# EAGLE schematic HshMain_v1.0 (EAGLE 7.4.0)
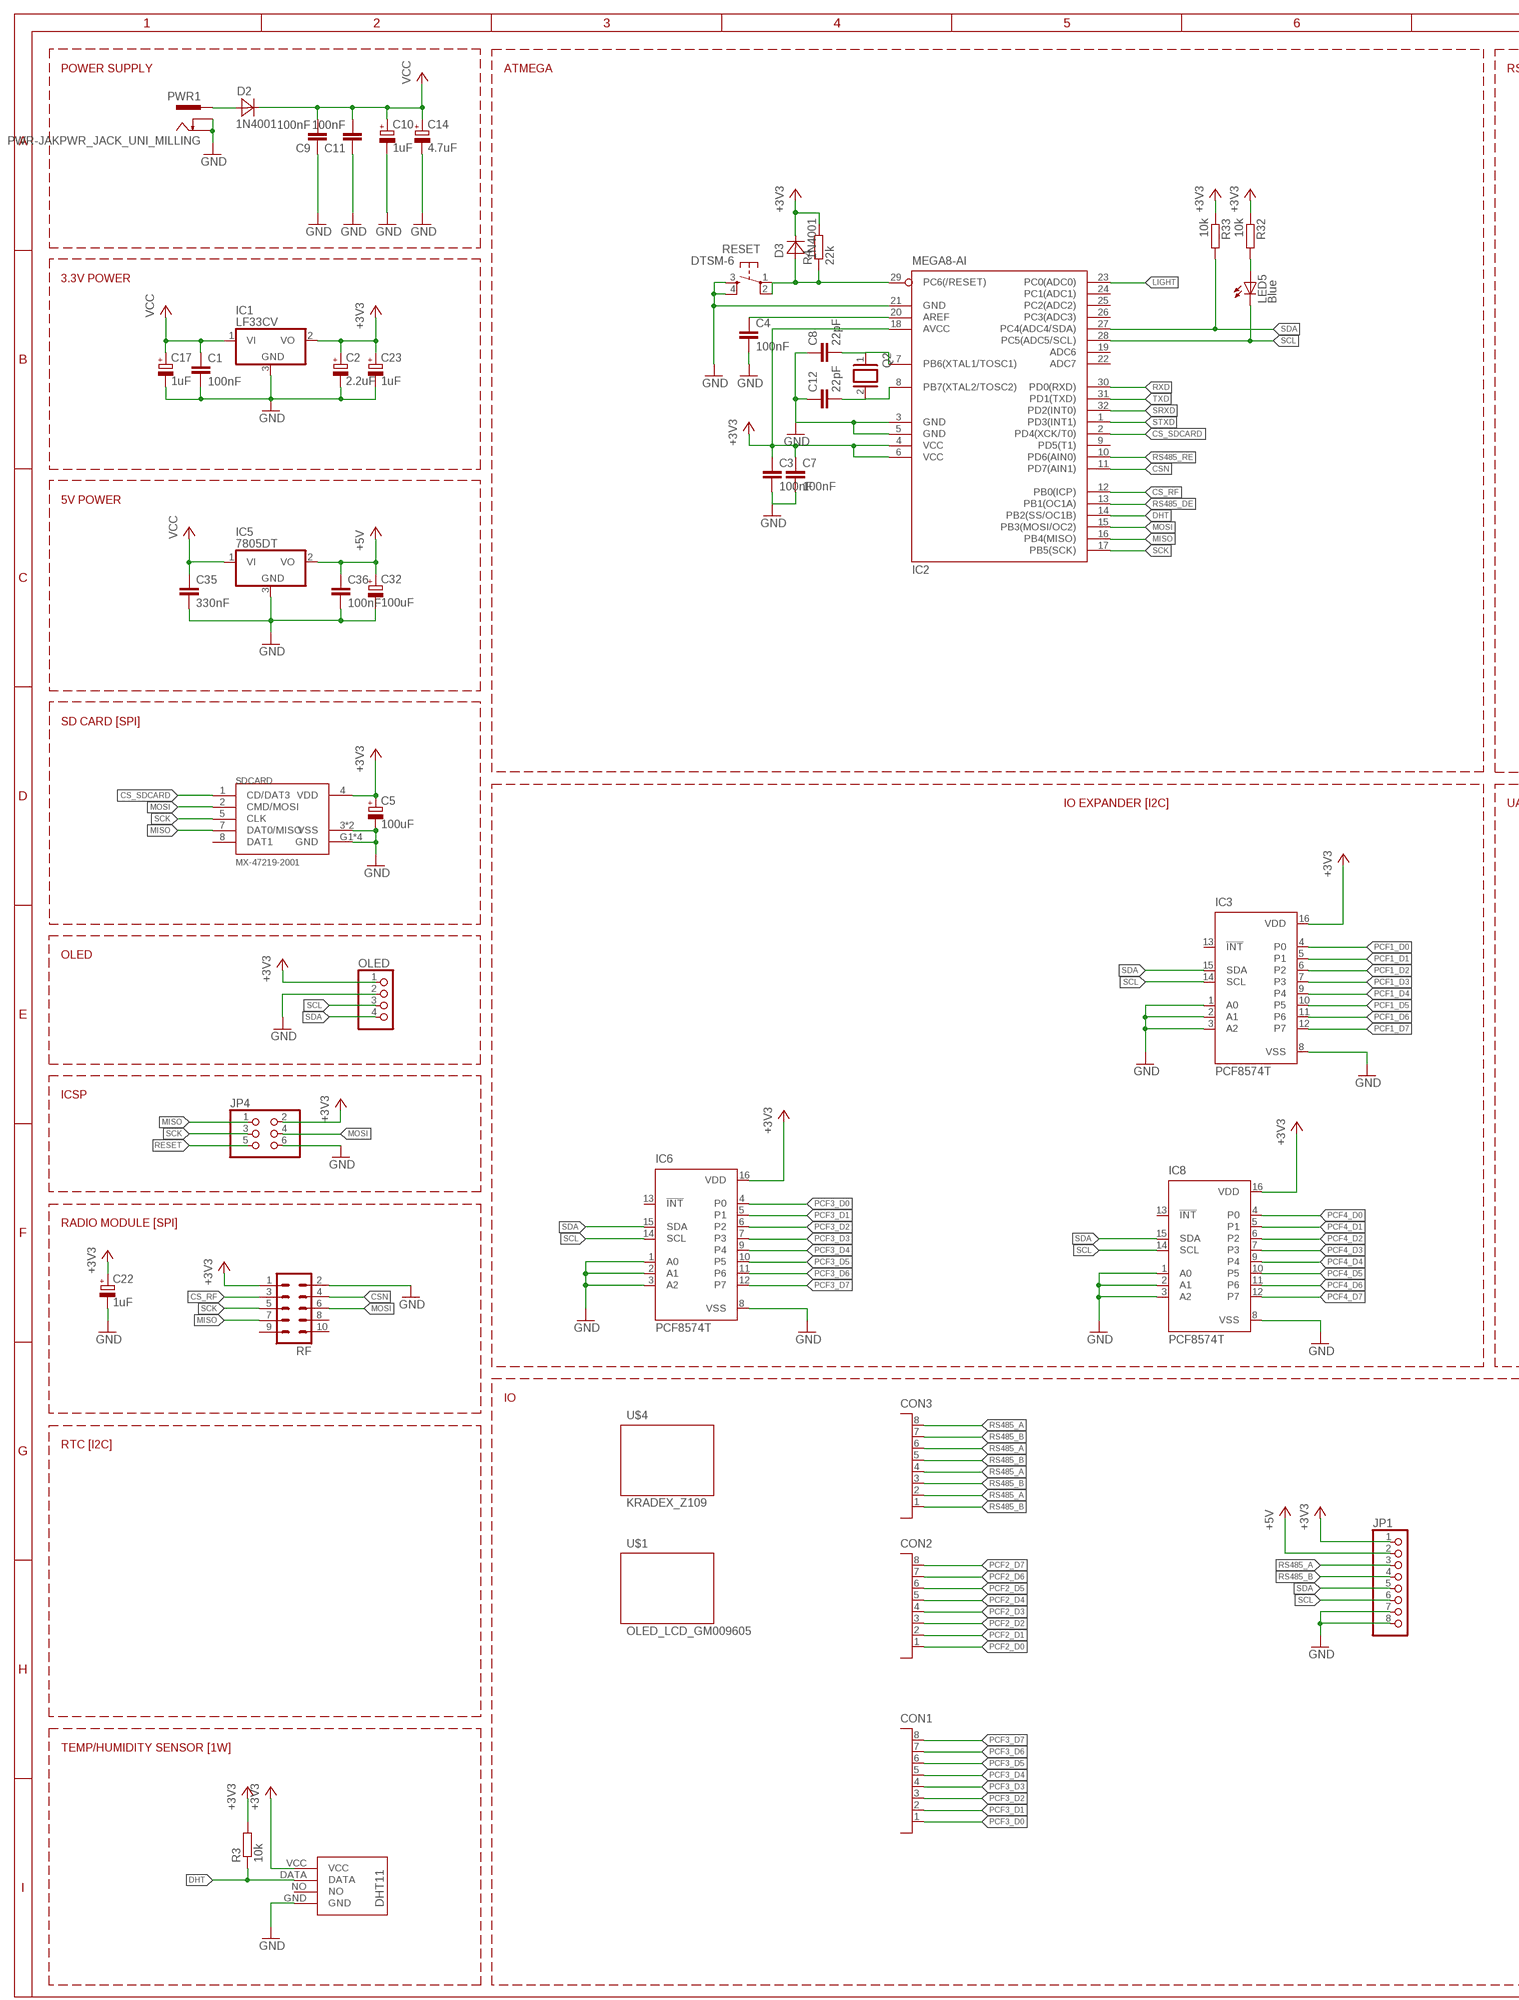
[diagram p0: schematic, sheet 1, part 1 of 2]
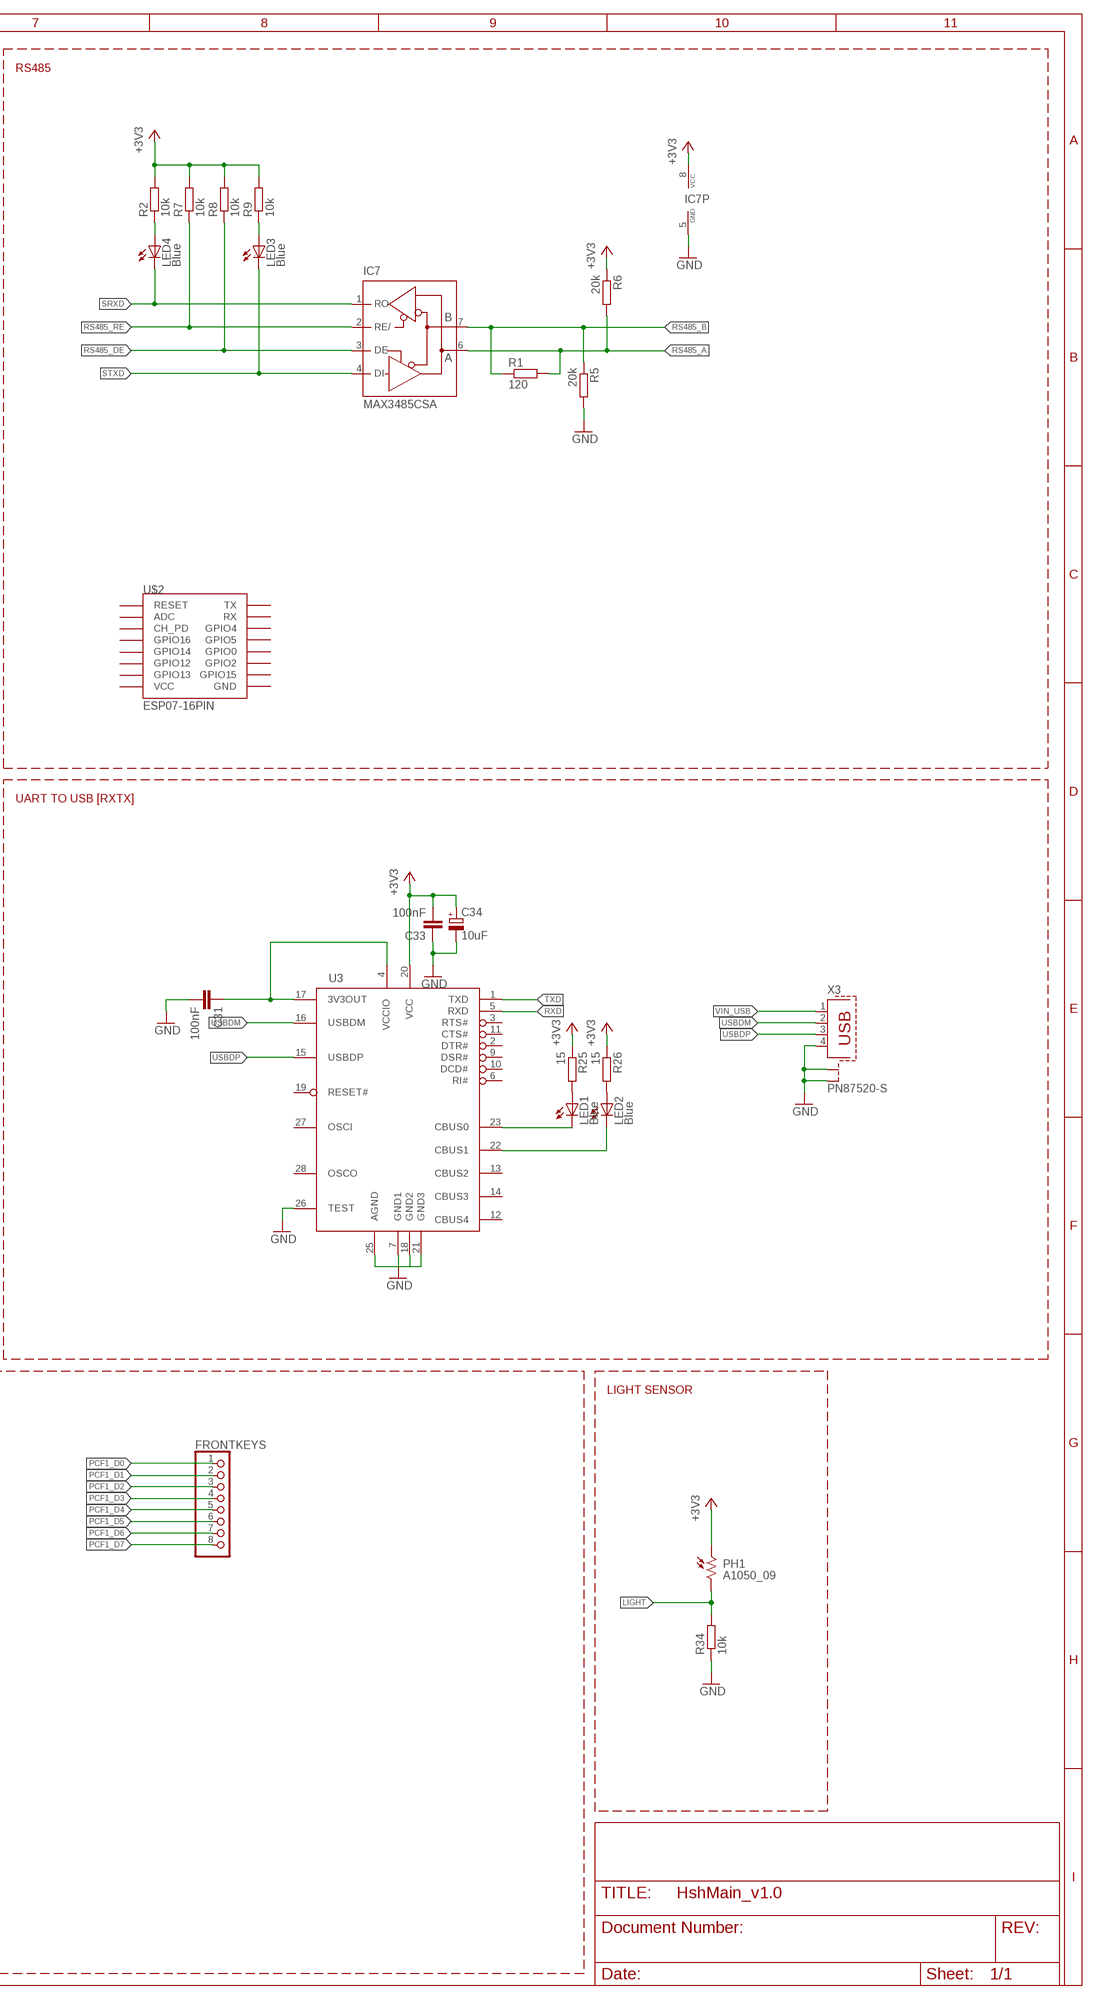
[diagram p1: schematic, sheet 1, part 2 of 2]

## Parts
C1  100nF  C-EUC0805  [C0805]
C2  2.2uF  CPOL-EUB  [PANASONIC_B]
C3  100nF  C-EUC0805  [C0805]
C4  100nF  C-EUC0805  [C0805]
C5  100uF  CPOL-EUD  [PANASONIC_D]
C7  100nF  C-EUC0805  [C0805]
C8  22pF  C-EUC0805  [C0805]
C9  100nF  C-EUC0805  [C0805]
C10  1uF  CPOL-EUB  [PANASONIC_B]
C11  100nF  C-EUC0805  [C0805]
C12  22pF  C-EUC0805  [C0805]
C14  4.7uF  CPOL-EUB  [PANASONIC_B]
C17  1uF  CPOL-EUB  [PANASONIC_B]
C22  1uF  CPOL-EUB  [PANASONIC_B]
C23  1uF  CPOL-EUB  [PANASONIC_B]
C31  100nF  C-EUC0805  [C0805]
C32  100uF  CPOL-EUD  [PANASONIC_D]
C33  100nF  C-EUC0805  [C0805]
C34  10uF  CPOL-EUB  [PANASONIC_B]
C35  330nF  C-EUC0805  [C0805]
C36  100nF  C-EUC0805  [C0805]
CON1  15EDGRC-3.81-8P  [15EDGRC-3.81-8P]
CON2  15EDGRC-3.81-8P  [15EDGRC-3.81-8P]
CON3  15EDGRC-3.81-8P  [15EDGRC-3.81-8P]
D2  1N4001  MBRA340T3  [SMA]
D3  1N4001  MBRA340T3  [SMA]
FRONTKEYS  PINHD-1X8/90  [1X08/90]
IC1  LF33CV  78DT  [TO252]
IC2  MEGA8-AI  [TQFP32-08]
IC3  PCF8574T  [SO16W]
IC5  7805DT  [TO252]
IC6  PCF8574T  [SO16W]
IC7  MAX3485CSA  MAX481CSA  [SO08]
IC8  PCF8574T  [SO16W]
JP1  PINHD-1X8/90  [1X08/90]
JP4  PINHD-2X3  [2X03]
LED1  Blue  LEDSML0805  [SML0805]
LED2  Blue  LEDSML0805  [SML0805]
LED3  Blue  LEDSML0805  [SML0805]
LED4  Blue  LEDSML0805  [SML0805]
LED5  Blue  LEDSML0805  [SML0805]
OLED  PINHD-1X4  [1X04]
PH1  A1050_09  [T0-46-A10XX]
PWR1  PWR-JAKPWR_JACK_UNI_MILLING  [PWR_JACK_UNI_MILLING]
Q2  XTAL/S  [QS]
R1  120  R-EU_R0805  [R0805]
R2  10k  R-EU_R0805  [R0805]
R3  10k  R-EU_R0805  [R0805]
R4  22k  R-EU_R0805  [R0805]
R5  20k  R-EU_R0805  [R0805]
R6  20k  R-EU_R0805  [R0805]
R7  10k  R-EU_R0805  [R0805]
R8  10k  R-EU_R0805  [R0805]
R9  10k  R-EU_R0805  [R0805]
R25  15  R-EU_R0805  [R0805]
R26  15  R-EU_R0805  [R0805]
R32  10k  R-EU_R0805  [R0805]
R33  10k  R-EU_R0805  [R0805]
R34  10k  R-EU_R0805  [R0805]
RESET  DTSM-6  [DTSM-6]
RF  ML10  [ML10]
SDCARD  MX-47219-2001  [MX-47219-2001]
U3  FT232RL  [SSOP28DB]
U$1  OLED_LCD_GM009605  [OLED_LCD_GM009605]
U$2  ESP07-16PIN  [ESP07-16PIN]
U$3  DHT11-PION.  [DHT11-PION.]
U$4  KRADEX_Z109  [KRADEX_Z109]
X3  PN87520-S  [PN87520-S]

## Nets
+3V3: C2.+ C3.1 C5.+ C7.1 C22.+ C23.+ C33.2 C34.+ D3.C IC1.2(VO) IC2.4(VCC) IC2.6(VCC) IC2.18(AVCC) IC3.16(VDD) IC6.16(VDD) IC7.8(VCC) IC8.16(VDD) JP1.1 JP4.2 OLED.1 PH1.1 R2.2 R3.2 R4.2 R6.1 R7.2 R8.2 R9.2 R25.1 R26.1 R32.1 R33.1 RF.1 SDCARD.4(VDD) U3.20(VCC) U$3.VCC
+5V: C32.+ C36.1 IC5.2(VO) JP1.2
CS_RF: IC2.12(PB0(ICP)) RF.3
CS_SDCARD: IC2.2(PD4(XCK/T0)) SDCARD.1(CD/DAT3)
CSN: IC2.11(PD7(AIN1)) RF.4
DHT: IC2.14(PB2(SS/OC1B)) R3.1 U$3.DATA
GND: C1.2 C2.- C3.2 C4.2 C5.- C7.2 C8.1 C9.1 C10.- C11.1 C12.1 C14.- C17.- C22.- C23.- C31.2 C32.- C33.1 C34.- C35.2 C36.2 IC1.3(GND) IC2.3(GND) IC2.5(GND) IC2.21(GND) IC3.1(A0) IC3.2(A1) IC3.3(A2) IC3.8(VSS) IC5.3(GND) IC6.1(A0) IC6.2(A1) IC6.3(A2) IC6.8(VSS) IC7.5(GND) IC8.1(A0) IC8.2(A1) IC8.3(A2) IC8.8(VSS) JP1.7 JP1.8 JP4.6 OLED.2 PWR1.- PWR1.-1(-) PWR1.-2(-) PWR1.-3(-) PWR1.-4(-) PWR1.-5(-) PWR1.-6(-) PWR1.-7(-) PWR1.-8(-) PWR1.-- PWR1.--1(--) PWR1.--2(--) PWR1.--3(--) PWR1.--4(--) PWR1.--5(--) PWR1.--6(--) PWR1.--7(--) PWR1.--8(--) R5.2 R34.1 RESET.3 RESET.4 RF.2 SDCARD.3(VSS) SDCARD.6(VSS) SDCARD.G1(GND) SDCARD.G2(GND) SDCARD.G3(GND) SDCARD.G4(GND) U3.7(GND1) U3.18(GND2) U3.21(GND3) U3.25(AGND) U3.26(TEST) U$3.GND X3.4 X3.S1 X3.S2
LIGHT: IC2.23(PC0(ADC0)) PH1.2 R34.2
MISO: IC2.16(PB4(MISO)) JP4.1 RF.7 SDCARD.7(DAT0/MISO)
MOSI: IC2.15(PB3(MOSI/OC2)) JP4.4 RF.6 SDCARD.2(CMD/MOSI)
N$1: C4.1 IC2.20(AREF)
N$2: LED4.A R2.1
N$3: LED3.A R9.1
N$4: D2.A PWR1.+ PWR1.+1(+) PWR1.+2(+) PWR1.+3(+) PWR1.+4(+) PWR1.+5(+) PWR1.+6(+) PWR1.+7(+) PWR1.+8(+)
N$5: LED5.A R32.2
N$27: LED1.C U3.23(CBUS0)
N$28: LED2.C U3.22(CBUS1)
N$29: C8.2 IC2.7(PB6(XTAL1/TOSC1)) Q2.1
N$32: LED1.A R25.2
N$33: LED2.A R26.2
N$35: C12.2 IC2.8(PB7(XTAL2/TOSC2)) Q2.2
N$96: C31.1 U3.4(VCCIO) U3.17(3V3OUT)
PCF1_D0: FRONTKEYS.1 IC3.4(P0)
PCF1_D1: FRONTKEYS.2 IC3.5(P1)
PCF1_D2: FRONTKEYS.3 IC3.6(P2)
PCF1_D3: FRONTKEYS.4 IC3.7(P3)
PCF1_D4: FRONTKEYS.5 IC3.9(P4)
PCF1_D5: FRONTKEYS.6 IC3.10(P5)
PCF1_D6: FRONTKEYS.7 IC3.11(P6)
PCF1_D7: FRONTKEYS.8 IC3.12(P7)
PCF2_D0: CON2.1
PCF2_D1: CON2.2
PCF2_D2: CON2.3
PCF2_D3: CON2.4
PCF2_D4: CON2.5
PCF2_D5: CON2.6
PCF2_D6: CON2.7
PCF2_D7: CON2.8
PCF3_D0: CON1.1 IC6.4(P0)
PCF3_D1: CON1.2 IC6.5(P1)
PCF3_D2: CON1.3 IC6.6(P2)
PCF3_D3: CON1.4 IC6.7(P3)
PCF3_D4: CON1.5 IC6.9(P4)
PCF3_D5: CON1.6 IC6.10(P5)
PCF3_D6: CON1.7 IC6.11(P6)
PCF3_D7: CON1.8 IC6.12(P7)
PCF4_D0: IC8.4(P0)
PCF4_D1: IC8.5(P1)
PCF4_D2: IC8.6(P2)
PCF4_D3: IC8.7(P3)
PCF4_D4: IC8.9(P4)
PCF4_D5: IC8.10(P5)
PCF4_D6: IC8.11(P6)
PCF4_D7: IC8.12(P7)
RESET: D3.A IC2.29(PC6(/RESET)) JP4.5 R4.1 RESET.1 RESET.2
RS485_A: CON3.2 CON3.4 CON3.6 CON3.8 IC7.6(A) JP1.3 R1.2 R6.2
RS485_B: CON3.1 CON3.3 CON3.5 CON3.7 IC7.7(B) JP1.4 R1.1 R5.1
RS485_DE: IC2.13(PB1(OC1A)) IC7.3(DE) R8.1
RS485_RE: IC2.10(PD6(AIN0)) IC7.2(RE/) R7.1
RXD: IC2.30(PD0(RXD)) U3.5(RXD)
SCK: IC2.17(PB5(SCK)) JP4.3 RF.5 SDCARD.5(CLK)
SCL: IC2.28(PC5(ADC5/SCL)) IC3.14(SCL) IC6.14(SCL) IC8.14(SCL) JP1.6 LED5.C OLED.3
SDA: IC2.27(PC4(ADC4/SDA)) IC3.15(SDA) IC6.15(SDA) IC8.15(SDA) JP1.5 OLED.4 R33.2
SRXD: IC2.32(PD2(INT0)) IC7.1(RO) LED4.C
STXD: IC2.1(PD3(INT1)) IC7.4(DI) LED3.C
TXD: IC2.31(PD1(TXD)) U3.1(TXD)
USBDM: U3.16(USBDM) X3.2
USBDP: U3.15(USBDP) X3.3
VCC: C1.1 C9.2 C10.+ C11.2 C14.+ C17.+ C35.1 D2.C IC1.1(VI) IC5.1(VI)
VIN_USB: X3.1
Unconnected: IC2.9(PD5(T1)) IC2.19(ADC6) IC2.22(ADC7) IC2.24(PC1(ADC1)) IC2.25(PC2(ADC2)) IC2.26(PC3(ADC3)) IC3.13(!INT) IC6.13(!INT) IC8.13(!INT) RF.8 RF.9 RF.10 SDCARD.8(DAT1) U3.2(DTR#) U3.3(RTS#) U3.6(RI#) U3.9(DSR#) U3.10(DCD#) U3.11(CTS#) U3.12(CBUS4) U3.13(CBUS2) U3.14(CBUS3) U3.19(RESET#) U3.27(OSCI) U3.28(OSCO) U$2.ADC U$2.CH_PD U$2.GND U$2.GPIO0 U$2.GPIO2 U$2.GPIO4 U$2.GPIO5 U$2.GPIO12 U$2.GPIO13 U$2.GPIO14 U$2.GPIO15 U$2.GPIO16 U$2.REST(RESET) U$2.RX U$2.TX U$2.VCC U$3.NO

## Notes on the sheet
- POWER SUPPLY | ATMEGA | RS485
- 3.3V POWER
- 5V POWER
- SD CARD [SPI]
- IO EXPANDER [I2C] | UART TO USB [RXTX]
- OLED
- ICSP
- RADIO MODULE [SPI]
- IO | LIGHT SENSOR
- RTC [I2C]
- TEMP/HUMIDITY SENSOR [1W]

## Library data of the parts
C1 C3 C4 C7-C9 C11 C12 C31 C33 C35 C36 = rcl:C-EU: CAPACITOR, European symbol
C2 C5 C10 C14 C17 C22 C23 C32 C34 = rcl:CPOL-EU: POLARIZED CAPACITOR, European symbol
CON1-CON3 = con-degson:15EDGRC-3.81-8P
D2 D3 = diode:MBRA340T3: Surface Mount Schottky Power Rectifier Source: http://www.onsemi.com/pub_link/Collateral/MBRA340T3-D.PDF
FRONTKEYS JP1 = pinhead:PINHD-1X8: PIN HEADER
IC1 = hosho:78*: Positive VOLTAGE REGULATOR Source: http://cache.national.com/ds/LM/LM78L05.pdf http://www.fairchildsemi.com/ds/LM/LM7805.pdf
IC2 = atmel:MEGA8: MICROCONTROLLER 8 Kbytes FLASH, 1 kbytes SRAM, 512 bytes EEPROM, USART, 6-channel 10 bit ADC, 2-channel 8 bit ADC Pin compatible with Atmega48, ATMega88, ATMega168 Source: avr.lbr; MPN: ATMEGA8-16AU; OC_FARNELL: 9171371; OC_NEWARK: 73M8863
IC3 IC6 IC8 = micro-philips:PCF8574: I2C-Bus Remote 8-bit I/O expander http://www.semiconductors.philips.com/acrobat_download/datasheets/PCF8574_4.pdf; MPN: PCF8574T/3,512; OC_FARNELL: 1201255; OC_NEWARK: 70R6870
IC5 = linear:78*: Positive VOLTAGE REGULATOR Source: http://cache.national.com/ds/LM/LM78L05.pdf http://www.fairchildsemi.com/ds/LM/LM7805.pdf
IC7 = maxim:MAX481CSA: RS485 TRANSEIVER; MF: MAXIM; MPN: MAX481CSA; OC_FARNELL: unknown; OC_NEWARK: 90C3817
JP4 = pinhead:PINHD-2X3: PIN HEADER
LED1-LED5 = led:LED: LED OSRAM: - CHIPLED LG R971, LG N971, LY N971, LG Q971, LY Q971, LO R971, LY R971 LH N974, LH R974 LS Q976, LO Q976, LY Q976 LO Q996 - Hyper CHIPLED LW Q18S LB Q993, LB Q99A, LB R99A - SideLED LS A670, LO A670, LY A670, LG A670, LP A670 LB A673, LV A673, LT A673, LW A673 LH A674 LY A675 LS A676, LA A676, LO A676, LY A676, LW A676 LS A679, LY A679, LG A679 - Hyper Micro SIDELED® LS Y876, LA Y876, LO Y876, LY Y876 LT Y87S - SmartLED LW L88C, LW L88S LB L89C, LB L89S, LG L890 LS L89K, LO L89K, LY L89K LS L896, LA L896, LO L896, LY L896 - TOPLED LS T670, LO T670, LY T670, LG T670, LP T670 LSG T670, LSP T670, LSY T670, LOP T670, LYG T670 LG T671, LOG T671, LSG T671 LB T673, LV T673, LT T673, LW T673 LH T674 LS T676, LA T676, LO T676, LY T676, LB T676, LH T676, LSB T676, LW T676 LB T67C, LV T67C, LT T67C, LS T67K, LO T67K, LY T67K, LW E67C LS E67B, LA E67B, LO E67B, LY E67B, LB E67C, LV E67C, LT E67C LW T67C LS T679, LY T679, LG T679 LS T770, LO T770, LY T770, LG T770, LP T770 LB T773, LV T773, LT T773, LW T773 LH T774 LS E675, LA E675, LY E675, LS T675 LS T776, LA T776, LO T776, LY T776, LB T776 LHGB T686 LT T68C, LB T68C - Hyper Mini TOPLED® LB M676 - Mini TOPLED Santana® LG M470 LS M47K, LO M47K, LY M47K Source: http://www.osram.convergy.de LUXEON: - LUMILED® LXK2-PW12-R00, LXK2-PW12-S00, LXK2-PW14-U00, LXK2-PW14-V00 LXK2-PM12-R00, LXK2-PM12-S00, LXK2-PM14-U00 LXK2-PE12-Q00, LXK2-PE12-R00, LXK2-PE12-S00, LXK2-PE14-T00, LXK2-PE14-U00 LXK2-PB12-K00, LXK2-PB12-L00, LXK2-PB12-M00, LXK2-PB14-N00, LXK2-PB14-P00, LXK2-PB14-Q00 LXK2-PR12-L00, LXK2-PR12-M00, LXK2-PR14-Q00, LXK2-PR14-R00 LXK2-PD12-Q00, LXK2-PD12-R00, LXK2-PD12-S00 LXK2-PH12-R00, LXK2-PH12-S00 LXK2-PL12-P00, LXK2-PL12-Q00, LXK2-PL12-R00 Source: www.luxeon.com KINGBRIGHT: KA-3528ASYC Source: www.kingbright.com
OLED = pinhead:PINHD-1X4: PIN HEADER
PH1 = photo-elements:A10: Sensor Robust Light Sensing Applications Outdoor Light Sensing Application Source: http://optoelectronics.perkinelmer.com/content/Datasheets/DTS_PhotocellsA1050.pdf
PWR1 = hosho:PWR-JAK
Q2 = special:XTAL/S: CRYSTAL
R1-R9 R25 R26 R32-R34 = rcl:R-EU_: RESISTOR, European symbol
RESET = hosho:DTSM-6
RF = con-harting-ml:ML10: HARTING; OC_FARNELL: unknown; OC_NEWARK: unknown
SDCARD = hosho:MX-47219-2001
U3 = ftdichip-5:FT232RL: USB UART 4th Generation USB UART (USB <-> Serial) Controller
U$1 = hosho:OLED_LCD_GM009605
U$2 = esp8266modules:ESP07-16PIN: ESP8266 Wifi module 07 - 16 pins; DIMENSIONS: 22.0 x 16.0 mm; PINS: 16; PITCH: 0.078" / 2 mm
U$3 = DHT11:DHT11-PION.: DHT11 Czujnik temperatury i wilgotności (widok pionowy)
U$4 = hosho:KRADEX_Z109
X3 = hosho:PN87520-S; OC_FARNELL: unknown; OC_NEWARK: unknown